# EAGLE design serial (EAGLE 6.2)
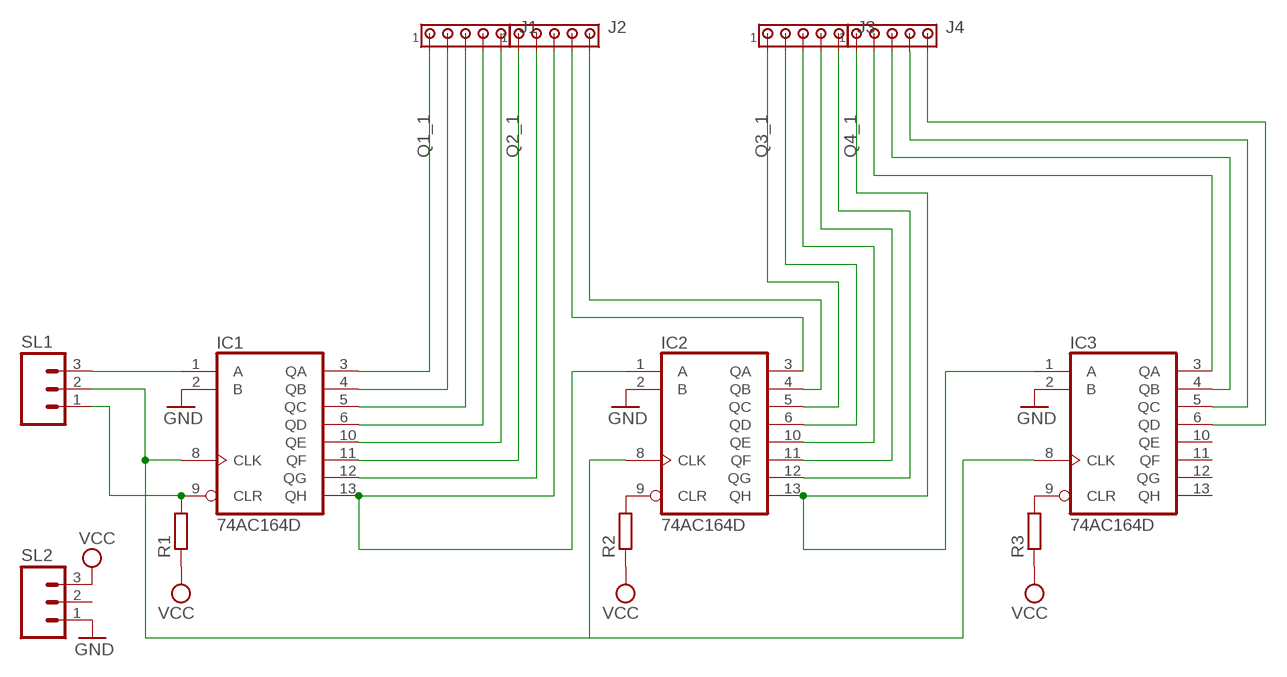
[diagram p0: schematic, sheet 1]

## Parts
IC1  74AC164D  [SO14]
IC2  74AC164D  [SO14]
IC3  74AC164D  [SO14]
J1  MTA05-100  [10X05MTA]
J2  MTA05-100  [10X05MTA]
J3  MTA05-100  [10X05MTA]
J4  MTA05-100  [10X05MTA]
R1  R-EU_R1206  [R1206]
R2  R-EU_R1206  [R1206]
R3  R-EU_R1206  [R1206]
SL1  M03  [03P]
SL2  M03  [03P]

## Nets
GND: IC1.2(B) IC2.2(B) IC3.2(B) SL2.1
N$1: IC1.1(A) SL1.3
N$3: IC1.4(QB) J1.2
N$4: IC1.5(QC) J1.3
N$5: IC1.6(QD) J1.4
N$6: IC1.10(QE) J1.5
N$8: IC1.12(QG) J2.2
N$9: IC1.13(QH) IC2.1(A) J2.3
N$10: IC1.8(CLK) IC2.8(CLK) IC3.8(CLK) SL1.2
N$11: IC1.9(CLR) R1.2 SL1.1
N$12: IC2.3(QA) J2.4
N$13: IC2.4(QB) J2.5
N$15: IC2.6(QD) J3.2
N$16: IC2.10(QE) J3.3
N$17: IC2.11(QF) J3.4
N$18: IC2.12(QG) J3.5
N$20: IC2.9(CLR) R2.2
N$21: IC3.3(QA) J4.2
N$22: IC3.4(QB) J4.3
N$23: IC3.5(QC) J4.4
N$24: IC3.6(QD) J4.5
N$25: IC3.9(CLR) R3.2
Q1_1: IC1.3(QA) J1.1
Q2_1: IC1.11(QF) J2.1
Q3_1: IC2.5(QC) J3.1
Q4_1: IC2.13(QH) IC3.1(A) J4.1
VCC: R1.1 R2.1 R3.1 SL2.3
Unconnected: IC3.10(QE) IC3.11(QF) IC3.12(QG) IC3.13(QH) SL2.2

## Power pins joined to a net without a drawn wire
GND: IC1.7(GND) IC2.7(GND) IC3.7(GND)
VCC: IC1.14(VCC) IC2.14(VCC) IC3.14(VCC)

## Library data of the parts
IC1-IC3 = 74xx-eu:74*164: 8-bit parallel out SHIFT REGISTER
J1-J4 = con-amp:MTA05-100: AMP connector
R1-R3 = rcl:R-EU_: RESISTOR, European symbol
SL1 SL2 = con-amp-quick:M03: AMP QUICK CONNECTOR; OC_FARNELL: unknown; OC_NEWARK: unknown

## Board
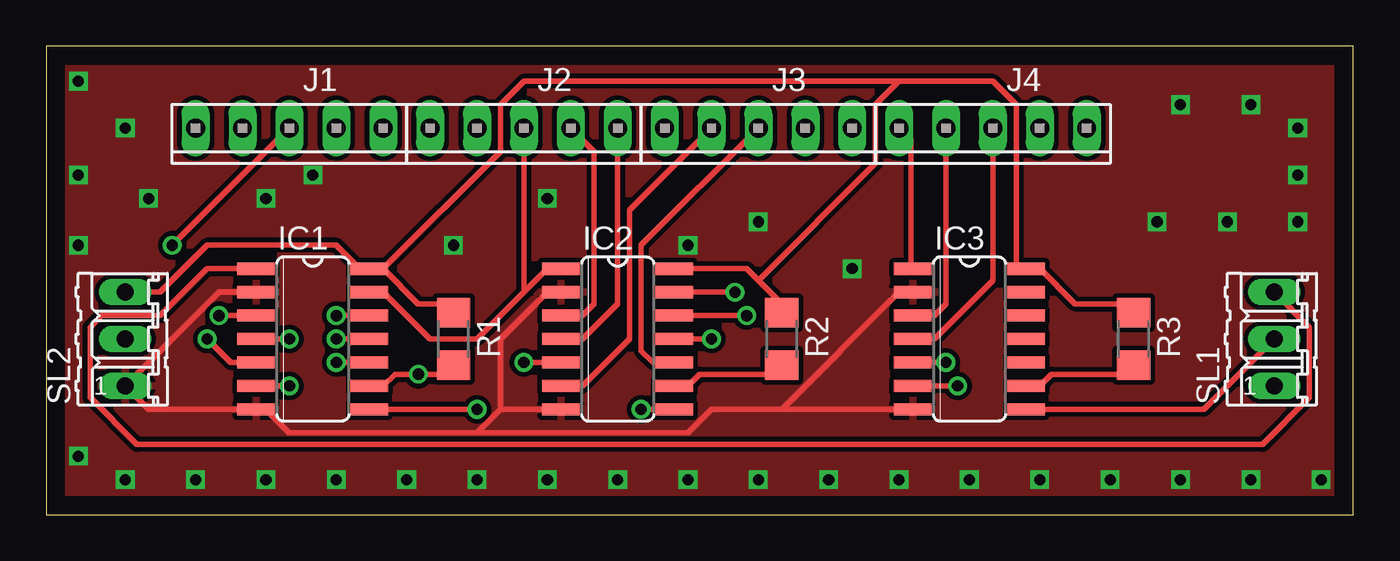
[diagram p1: board, top side]
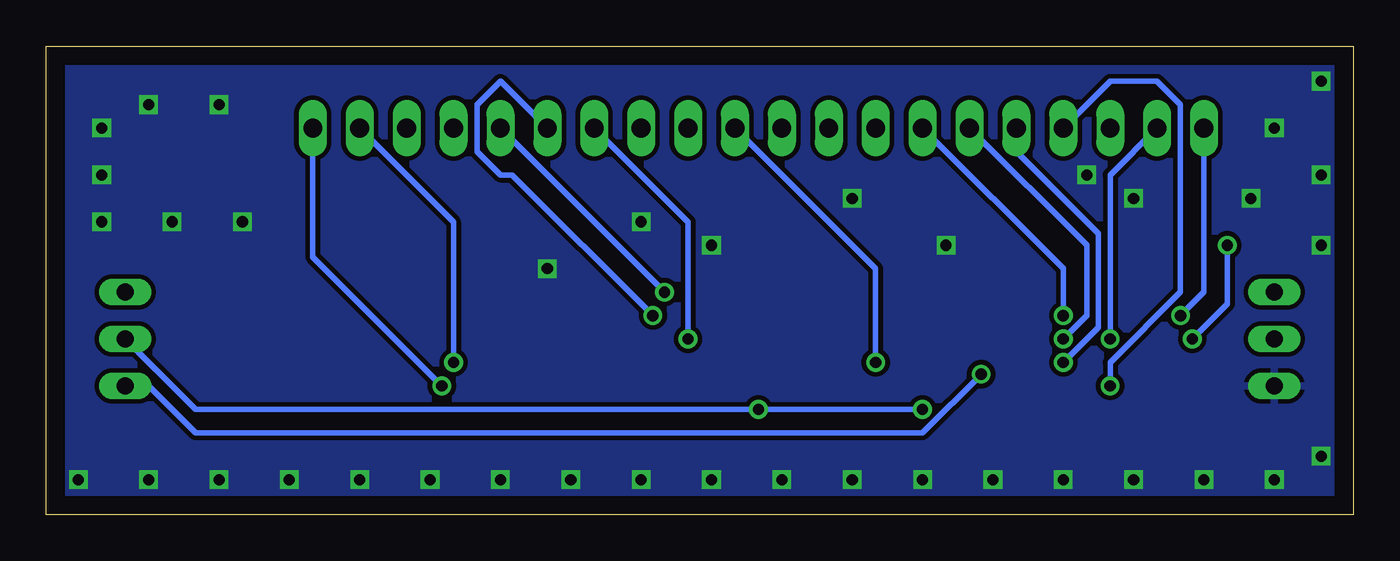
[diagram p2: board, bottom side, seen from below]

Size 70.79 x 25.39 mm. Coordinates in mm from the lower left corner, seen from the top.
Outline: 0,0 70.79,0 70.79,25.39 0,25.39 0,0
Copper layers (1*16): Top 0.035mm / dielectric 1.5mm / Bottom 0.035mm
Design rules: minimum track width 12mil, minimum drill 24mil, track to track 10mil, track to pad 10mil, pad to pad 8mil, via to via 8mil, smd to smd 8mil, copper to edge 40mil, drill to drill 8mil, minimum pad ring 10mil, minimum via ring 8mil, stop-mask expansion 4mil, vias tented up to drill 0mil, thermal gap 10mil

### Footprints (pad centres in the part's own frame; a part is rotated, then mirrored left to right if it is on the bottom)
SO14 = smd 0.66 x 2.032: 1 -3.81,-3.073; 2 -2.54,-3.073; 3 -1.27,-3.073; 4 0,-3.073; 5 1.27,-3.073; 6 2.54,-3.073; 7 3.81,-3.073; 8 3.81,3.073; 9 2.54,3.073; 10 1.27,3.073; 11 0,3.073; 12 -1.27,3.073; 13 -2.54,3.073; 14 -3.81,3.073
10X05MTA = drill 1.016 long: 1 5.08,0; 2 2.54,0; 3 0,0; 4 -2.54,0; 5 -5.08,0
R1206 = smd 1.6 x 1.803: 1 -1.422,0; 2 1.422,0
03P = drill 0.914 long: 1 -2.54,0; 2 0,0; 3 2.54,0

### Placement (x,y rotation side)
IC1  14.44,9.52 270 top
IC2  30.95,9.52 270 top
IC3  50,9.52 270 top
J1  13.17,20.95 180 top
J2  25.87,20.95 180 top
J3  38.57,20.95 180 top
J4  51.27,20.95 180 top
R1  22.06,9.52 270 top
R2  39.84,9.52 270 top
R3  58.89,9.52 270 top
SL1  66.51,9.52 90 top
SL2  4.28,9.52 90 top

### Tracks (layer width: path | path; a pad name or v marks a point on that pad's centre or on a via)
GND  (via drill 0.6)
  Top 0.305: 24.6,5.71 IC2.7 | 23.33,4.44 24.6,5.71 | 23.33,4.44 13.17,4.44 11.9,5.71 IC1.7 5.55,5.71 SL2.1 9.36,12.06 IC1.2 | IC2.2 27.14,12.06 24.6,9.52 24.6,5.71 | 39.84,5.71 36.03,5.71 34.76,4.44 23.33,4.44 | 39.84,5.71 IC3.7 | IC3.2 46.19,12.06 39.84,5.71
  other vias: 5.55,17.14 4.28,20.95 1.74,18.41 1.74,23.49 1.74,14.6 1.74,3.17 4.28,1.9 8.09,1.9 11.9,1.9 15.71,1.9 19.52,1.9 23.33,1.9 27.14,1.9 30.95,1.9 22.06,14.6 38.57,15.87 34.76,14.6 27.14,17.14 43.65,13.33 60.16,15.87 63.97,15.87 67.78,15.87 67.78,18.41 67.78,20.95 65.24,22.22 61.43,22.22 34.76,1.9 38.57,1.9 42.38,1.9 46.19,1.9 50,1.9 53.81,1.9 57.62,1.9 61.43,1.9 65.24,1.9 69.05,1.9 11.9,17.14 14.44,18.41
  pour Bottom: 0.47,24.76 70.32,24.76 70.32,0.63 0.47,0.63
  pour Top: 0.47,24.76 70.32,24.76 70.32,0.63 0.47,0.63
N$1
  Top 0.305: IC1.1 8.73,13.33 6.18,10.79 3.01,10.79 2.38,10.15 2.38,6.35 4.92,3.81 65.88,3.81 68.42,6.35 68.42,10.15 SL1.3
N$3  (via drill 0.61)
  Top 0.305: v13.17,9.52 IC1.4
  Bottom 0.305: v13.17,9.52 13.17,18.41 J1.2
N$4  (via drill 0.61)
  Top 0.305: IC1.5 10,8.25 v8.73,9.52 | J1.3 v6.82,14.6
  Bottom 0.305: v8.73,9.52 6.82,11.42 v6.82,14.6
N$5  (via drill 0.61)
  Top 0.305: v13.17,6.98 IC1.6
  Bottom 0.305: v13.17,6.98 13.17,8.25 9.36,12.06 9.36,22.22 10.63,23.49 13.17,23.49 J1.4
N$6  (via drill 0.61)
  Top 0.305: v15.71,8.25 IC1.10
  Bottom 0.305: v15.71,8.25 13.8,10.15 13.8,15.24 18.25,19.68 J1.5
N$8  (via drill 0.61)
  Top 0.305: v15.71,10.79 IC1.12
  Bottom 0.305: v15.71,10.79 15.71,13.33 J2.2
N$9
  Top 0.305: IC1.13 18.25,12.06 20.79,9.52 23.33,9.52 25.87,12.06 | 25.87,12.06 27.14,13.33 IC2.1 | 25.87,12.06 J2.3
N$10  (via drill 0.61)
  Top 0.305: v23.33,5.71 IC1.8 | v32.22,5.71 IC2.8 | IC3.8 62.7,5.71 SL1.2
  Bottom 0.305: v23.33,5.71 v32.22,5.71 62.7,5.71 SL1.2
N$11  (via drill 0.61)
  Top 0.305: IC1.9 18.25,6.98 18.89,7.62 v20.16,7.62 22.06,7.62 R1.2
  Bottom 0.305: SL1.1 65.24,6.98 62.7,4.44 23.33,4.44 v20.16,7.62
N$12
  Top 0.305: IC2.3 29.04,10.79 29.68,11.42 29.68,19.68 J2.4
N$13
  Top 0.305: IC2.4 29.04,9.52 30.95,11.42 J2.5
N$15
  Top 0.305: IC2.6 29.04,6.98 31.59,9.52 31.59,16.51 J3.2
N$16
  Top 0.305: IC2.10 32.85,8.25 32.22,8.88 32.22,14.6 J3.3
N$17  (via drill 0.61)
  Top 0.305: v36.03,9.52 IC2.11
  Bottom 0.305: v36.03,9.52 36.03,15.87 J3.4
N$18  (via drill 0.61)
  Top 0.305: v37.93,10.79 IC2.12
  Bottom 0.305: v37.93,10.79 45.55,18.41 46.19,18.41 47.46,19.68 47.46,22.22 46.19,23.49 J3.5
N$20
  Top 0.305: IC2.9 34.76,6.98 35.39,7.62 39.84,7.62 R2.2
N$21
  Top 0.305: IC3.3 48.09,10.79 48.73,11.42 J4.2
N$22
  Top 0.305: IC3.4 48.09,9.52 51.27,12.7 J4.3
N$23  (via drill 0.61)
  Top 0.305: v48.73,8.25 IC3.5
  Bottom 0.305: v48.73,8.25 48.73,15.87 J4.4
N$24  (via drill 0.61)
  Top 0.305: v49.36,6.98 IC3.6
  Bottom 0.305: v49.36,6.98 56.35,13.97 J4.5
N$25
  Top 0.305: IC3.9 53.81,6.98 54.45,7.62 58.89,7.62 R3.2
Q1_1  (via drill 0.61)
  Top 0.305: v9.36,10.79 IC1.3
  Bottom 0.305: v9.36,10.79 8.09,12.06 J1.1
Q2_1  (via drill 0.61)
  Top 0.305: v15.71,9.52 IC1.11
  Bottom 0.305: v15.71,9.52 14.44,10.79 14.44,14.6 J2.1
Q3_1  (via drill 0.61)
  Top 0.305: v25.87,8.25 IC2.5
  Bottom 0.305: v25.87,8.25 25.87,13.33 J3.1
Q4_1  (via drill 0.61)
  Top 0.305: v37.3,12.06 IC2.13 | J4.1 46.82,20.31 46.82,13.33 IC3.1
  Bottom 0.305: J4.1 v37.3,12.06
VCC
  Top 0.305: 18.25,13.33 20.16,11.42 22.06,11.42 R1.1 | IC1.14 18.25,13.33 | SL2.3 6.18,12.06 8.73,14.6 15.71,14.6 16.98,13.33 IC1.14 | 38.57,12.7 37.93,13.33 IC2.14 | 38.57,12.7 39.84,11.42 R2.1 | R3.1 58.89,11.42 55.71,11.42 53.81,13.33 IC3.14 52.54,13.33 52.54,22.22 51.27,23.49 46.19,23.49 | 38.57,12.7 44.92,19.05 44.92,22.22 46.19,23.49 | 18.25,13.33 24.6,19.68 24.6,22.22 25.87,23.49 46.19,23.49 | 17.62,13.33 IC1.14